# Altium schematic sheet POWER_CONTROLLER.SchDoc
size B
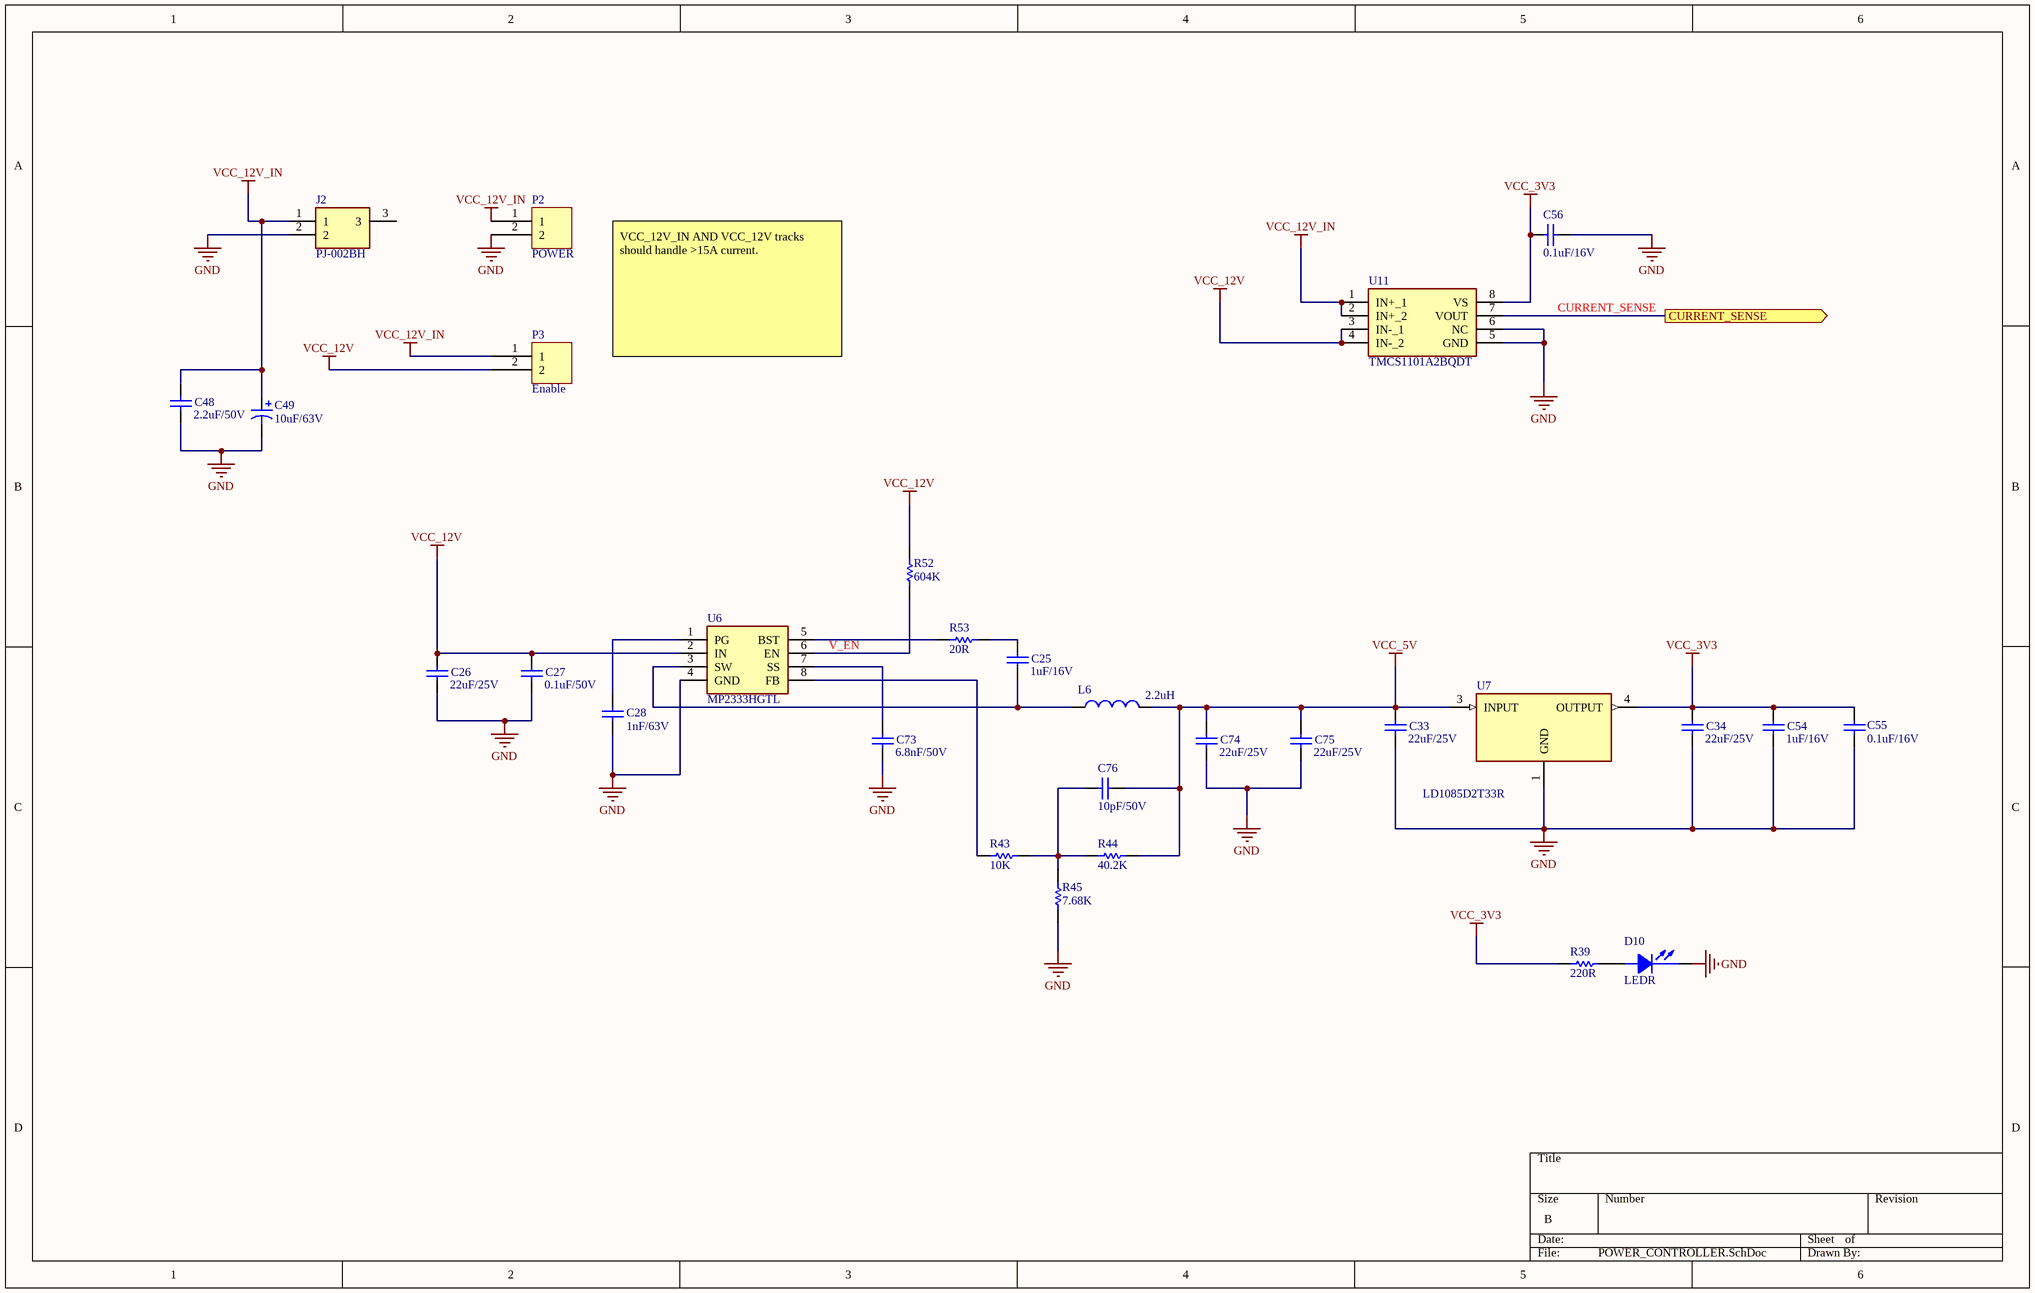
[diagram p0: POWER_CONTROLLER.SchDoc]

## Parts
C25  1uF/16V  [0603C]
C26  22uF/25V  [1210C]
C27  0.1uF/50V  [0603C]
C28  1nF/63V  [0603C]
C33  22uF/25V  [1210C]
C34  22uF/25V  [1210C]
C48  2.2uF/50V  [0603C]
C49  10uF/63V  [EEE-FN1J100L]
C54  1uF/16V  [0603C]
C55  0.1uF/16V  [0603C]
C56  0.1uF/16V  [0603C]
C73  6.8nF/50V  [0603C]
C74  22uF/25V  [1210C]
C75  22uF/25V  [1210C]
C76  10pF/50V  [0603C]
D10  LEDR  [LED_0603]
J2  PJ-002BH  [PJ002BH]
L6  2.2uH  [IHLP1616BZER2R2M5A]
P2  POWER  [HEADER_2]
P3  Enable  [HEADER_2]
R39  220R  [0603R]
R43  10K  [0603R]
R44  40.2K  [0603R]
R45  7.68K  [0603R]
R52  604K  [0603R]
R53  20R  [0603R]
U6  MP2333HGTL  [MP2333HGTL-P]
U7  LD1085D2T33R  [LD1085D2T33R]
U11  TMCS1101A2BQDT  [SOIC127P600X175-8N]

## Ports
CURRENT_SENSE (out)

## Nets
GND: C26.1 C27.1 C28.1 C33.1 C34.1 C48.1 C49.2 C54.1 C55.2 C56.2 C73.1 C74.1 C75.1 D10.2(CATHODE) J2.2 P2.2 R45.2 U6.4(GND) U7.1(GND) U11.5(GND) U11.6(NC)
VCC_3V3: C34.2 C54.2 C55.1 C56.1 R39.2 U7.4(OUTPUT) U11.8(VS)
VCC_5V: C33.2 C74.2 C75.2 C76.1 L6.2 R44.2 U7.3(INPUT)
VCC_12V: C26.2 C27.2 P3.2 R52.2 U6.2(IN) U11.3(IN-_1) U11.4(IN-_2)
VCC_12V_IN: C48.2 C49.1 J2.1 P2.1 P3.1 U11.1(IN+_1) U11.2(IN+_2)
CURRENT_SENSE: U11.7(VOUT) ; port CURRENT_SENSE
V_EN: R52.1 U6.6(EN)
NetC25_1: C25.1 L6.1 U6.3(SW)
NetC25_2: C25.2 R53.2
NetC28_2: C28.2 U6.1(PG)
NetC73_2: C73.2 U6.7(SS)
NetC76_2: C76.2 R43.1 R44.1 R45.1
NetD10_1: D10.1(ANODE) R39.1
NetR43_2: R43.2 U6.8(FB)
NetR53_1: R53.1 U6.5(BST)

Not connected (* = marked no-connect by the designer): J2 3

## Notes on the sheet
- VCC_12V_IN AND VCC_12V tracks should handle >15A current.

## Library data of the parts
C25 C54 = Cap: Multilayer Ceramic Capacitors MLCC - SMD/SMT 16volts 1uF X7R 10%; Mfr: KEMET; Mfr Part No: C0603C105K4RAC7411; Package: 0603; Price: 0.101; Stockiest: MOUSER; Stockiest Part No: 80-C0603C105K4RLR; Value: 1uF/16V
C26 C33 C34 C74 C75 = Cap: Multilayer Ceramic Capacitors MLCC - SMD/SMT 1210 25VDC 22uF 20% X7R AEC-Q200; Mfr: Taiyo Yuden; Mfr Part No: TMK325B7226MMHP; Package: 1210; Price: 0.807; Stockiest: MOUSER; Stockiest Part No: 963-TMK325B7226MMHP; Value: 22uF/25V
C27 = Cap: Multilayer Ceramic Capacitors MLCC - SMD/SMT 50V 0.1uF 0603 X7R 20%; Mfr: KEMET; Mfr Part No: C0603C104M5RACTU; Package: 0603; Price: 0.101; Stockiest: MOUSER; Stockiest Part No: 80-C0603C104M5R; Value: 0.1uF/50V
C28 = Cap: Multilayer Ceramic Capacitors MLCC - SMD/SMT 63V 1000pF 0603 X7R 10% AEC-Q200; Mfr: KEMET; Mfr Part No: 80-C0603C102KMREAUTO; Package: 0603; Price: 0.201; Stockiest: MOUSER; Stockiest Part No: C0603C102KMRECAUTO; Value: 1nF/63V
C48 = Cap: Multilayer Ceramic Capacitors MLCC - SMD/SMT 0603 2.2uF 20% 50VDC X5R; Mfr: Murata Electronics; Mfr Part No: GRM188R61H225ME11J; Package: 0603; Price: 0.333; Stockiest: MOUSER; Stockiest Part No: 81-GRM188R61H225ME1J; Value: 2.2uF/50V
C49 = Cap Pol1: Polarized Capacitor (Radial); Mfr: Panasonic; Value: 10uF/63V; Mfr Part No: EEE-FN1J100L; Package: SMD; Stockiest: MOUSER; Price: 0.484; Stockiest Part No: 667-EEE-FN1J100L
C55 C56 = Cap: Multilayer Ceramic Capacitors MLCC - SMD/SMT 0603 16VDC 0.1uF 10% X7R AEC-Q2000; Mfr: Taiyo Yuden; Mfr Part No: EMK107B7104KAHT; Value: 0.1uF/16V; Package: 0603; Price: 0.101; Stockiest: MOUSER; Stockiest Part No: 963-EMK107B7104KAHT
C73 = Cap: Multilayer Ceramic Capacitors MLCC - SMD/SMT 0603 50VDC 6.8nF 5% C0G AEC-Q200; Mfr: TDK; Mfr Part No: CGA3E2C0G1H682J080AE; Package: 0603; Price: 0.363; Stockiest: MOUSER; Stockiest Part No: 810-CGA3E2C0G1H682J8; Value: 6.8nF/50V
C76 = Cap: Multilayer Ceramic Capacitors MLCC - SMD/SMT 50V 10pF 0603 C0G 5% AEC-Q200; Mfr: KEMET; Mfr Part No: C0603C100J5GACAUTO; Package: 0603; Price: 0.192; Stockiest: MOUSER; Stockiest Part No: 80-C0603C100J5GAUTO; Value: 10pF/50V
D10 = LED: Standard LEDs - SMD Red 631nm 14mcd 5mA; Mfr: Lite On; Mfr Part No: LTST-C193KRKT-5A; Package: 0603; Price: 0.28; Stockiest: MOUSER; Stockiest Part No: 859-LTSTC193KRKT5A; Value: RED
J2 = PJ-002BH: Connector; Mfr Part No: PJ-002BH
L6 = INDUCTOR: Fixed Inductors 2.2uH 20% High Temp AEC-Q200; Mfr: Vishay / Dale; Mfr Part No: IHLP1616BZER2R2M5A; Price: 1.36; Stockiest: MOUSER; Stockiest Part No: 70-IHLP1616BZR2R2M5A; Value: 2.2uH
P2 P3 = HEADER_2
R39 = Res1: Thick Film Resistors - SMD 1/10Watt 220ohms 5% Commercial Use; Mfr: Vishay / Dale; Mfr Part No: CRCW0603220RJNEAC; Package: 0603; Price: 0.101; Stockiest: MOUSER; Stockiest Part No: 71-CRCW0603220RJNEAC; Value: 220R
R43 = Res1: Thick Film Resistors - SMD 0603 10Kohms 1% Anti-Sulfur AEC-Q200; Mfr: ROHM Semiconductor; Mfr Part No: SFR03EZPF1002; Package: 0603; Price: 0.101; Stockiest: MOUSER; Stockiest Part No: 755-SFR03EZPF1002; Value: 10K
R44 = Res1: Thick Film Resistors - SMD 0603 Anti-Surge Res. 0.1%, 40.2Koh; Mfr: Panasonic; Mfr Part No: ERJ-PB3B4022V; Package: 0603; Price: 0.252; Stockiest: MOUSER; Stockiest Part No: 667-ERJ-PB3B4022V; Value: 40.2K
R45 = Res1: Thick Film Resistors - SMD 0603 Anti-Surge Res. 0.1%, 7.68Koh; Mfr: Panasonic; Mfr Part No: ERJ-PB3B7681V; Package: 0603; Price: 0.252; Stockiest: MOUSER; Stockiest Part No: 667-ERJ-PB3B7681V; Value: 7.68K
R52 = Res1: Thick Film Resistors - SMD 0603 1% 604Kohm Anti-Sulfur AEC-Q200; Mfr: Panasonic; Mfr Part No: ERJ-U03F6043V; Package: 0603; Price: 0.221; Stockiest: MOUSER; Stockiest Part No: 667-ERJ-U03F6043V; Value: 604K
R53 = Res1: Thick Film Resistors - SMD 0603 0.25W 1% 20ohm AEC-Q200; Mfr: Panasonic; Mfr Part No: ERJ-UP3F20R0V; Package: 0603; Price: 0.262; Stockiest: MOUSER; Stockiest Part No: 667-ERJ-UP3F20R0V; Value: 20R
U6 = MP2333HGTL: Switching Voltage Regulators High-Efficiency, 3A, 18V, 1200kHz, Synchronous, Step-Down Converter; Mfr: Monolithic Power Systems (MPS); Value: 3.3V; Mfr Part No: MP2333HGTL-P; Price: 1.89; Stockiest: MOUSER; Stockiest Part No: 946-MP2333HGTL-P
U7 = LD1085D2T33R: Integrated Circuit; Mfr: STMicroelectronics; Value: 3.3V; Mfr Part No: LD1085D2T33R; Price: 1.30; Stockiest: MOUSER; Stockiest Part No: 511-LD1085D2T33-TR
U11 = TMCS1101A1BQDR: Board Mount Current Sensors Precision isolated current sensor with internal reference 8-SOIC -40 to 125; Mfr: Texas Instruments; Mfr Part No: TMCS1101A2BQDT; Price: 5.22; Stockiest: MOUSER; Stockiest Part No: 595-TMCS1101A2BQDT